# EAGLE design Keyboard (EAGLE 9.5.2)
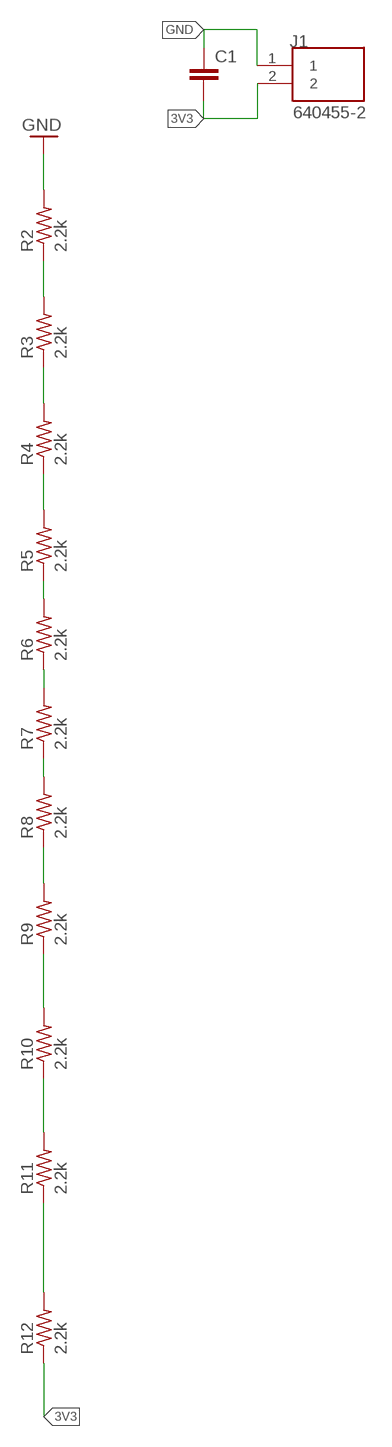
[diagram p0: schematic, sheet 1]

## Parts
C1  C-EUC0603  [C0603]
J1  640455-2  [TE_640455-2]
R2  2.2k  R-US_R0603  [R0603]
R3  2.2k  R-US_R0603  [R0603]
R4  2.2k  R-US_R0603  [R0603]
R5  2.2k  R-US_R0603  [R0603]
R6  2.2k  R-US_R0603  [R0603]
R7  2.2k  R-US_R0603  [R0603]
R8  2.2k  R-US_R0603  [R0603]
R9  2.2k  R-US_R0603  [R0603]
R10  2.2k  R-US_R0603  [R0603]
R11  2.2k  R-US_R0603  [R0603]
R12  2.2k  R-US_R0603  [R0603]

## Nets
3V3: C1.2 J1.2 R12.1
GND: C1.1 J1.1 R2.2
STEP2: R2.1 R3.2
STEP3: R3.1 R4.2
STEP4: R4.1 R5.2
STEP5: R5.1 R6.2
STEP6: R6.1 R7.2
STEP7: R7.1 R8.2
STEP8: R8.1 R9.2
STEP9: R9.1 R10.2
STEP10: R10.1 R11.2
STEP11: R11.1 R12.2

## Library data of the parts
C1 = rcl:C-EU: CAPACITOR, European symbol; SPICEPREFIX: C
J1 = 640455-2:640455-2; AVAILABILITY: Unavailable; COMMENT: 640455-2; DESCRIPTION: MTA-100 2 Position 2.54 mm Single Row Right Angle Wire to Board Header; EU_ROHS_COMPLIANCE: Compliant; MF: TE Connectivity; MP: 640455-2; PACKAGE: None; PRICE: None; TE_PURCHASE_URL: https://www.te.com/usa-en/product-640455-2.html?te_bu=Cor&te_type=disp&te_campaign=seda_glo_cor-seda-global-disp-prtnr-fy19-seda-model-bom-cta_sma-317_1&elqCampaignId=32493
R2-R12 = rcl:R-US_: RESISTOR, American symbol

## Board
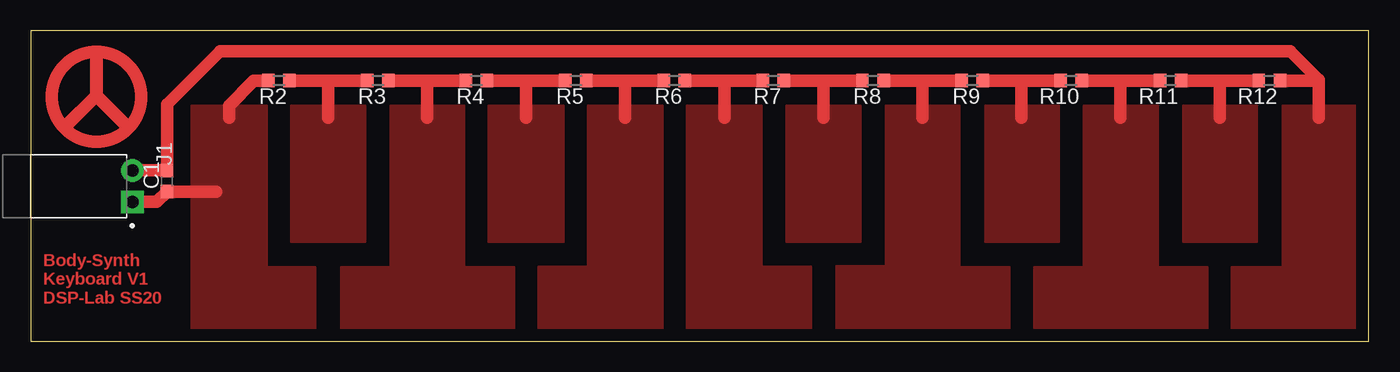
[diagram p1: board, top side]

Size 108.02 x 25.03 mm. Coordinates in mm from the lower left corner, seen from the top.
Outline: 0,0 108.02,0 108.02,25.03 0,25.03 0,0
Copper layers (1*16): Top 0.035mm / dielectric 1.5mm / Bottom 0.035mm
Design rules "Projektlabor_THT_DRC_2019": minimum track width 0.8mm, minimum drill 0.6mm, track to track 15mil, track to pad 12mil, pad to pad 16mil, via to via 20mil, smd to smd 8mil, copper to edge 40mil, drill to drill 16mil, minimum pad ring 16mil, minimum via ring 14mil, stop-mask expansion 4mil, vias tented up to drill 0mil, thermal gap 15mil

### Footprints (pad centres in the part's own frame; a part is rotated, then mirrored left to right if it is on the bottom)
C0603 = smd 1.1 x 1: 1 -0.85,0; 2 0.85,0
TE_640455-2 = drill 1.02 pad 1.37 square: 1 0,0 | drill 1.02 pad 1.37: 2 -2.54,0
R0603 = smd 1 x 1.1: 1 -0.85,0; 2 0.85,0

### Placement (x,y rotation side)
C1  10.99,12.91 90 top
J1  8.19,11.23 270 top
R2  20.02,21.03 180 top
R3  28.01,21.03 180 top
R4  35.96,21.03 180 top
R5  44.01,21.03 180 top
R6  51.96,21.03 180 top
R7  59.95,21.03 180 top
R8  68,21.03 180 top
R9  76.02,21.03 180 top
R10  84,21.03 180 top
R11  92.02,21.03 180 top
R12  100.01,21.03 180 top

### Tracks (layer width: path | path; a pad name or v marks a point on that pad's centre or on a via)
3V3
  Top 0.813: C1.2
  Top 1.016: R12.1 103.99,21.03 | 103.99,18.01 103.99,21.03 | 103.99,21.03 103.99,21.11 101.69,23.41 15.29,23.41 10.99,19.11 C1.2 | J1.2 C1.2
  pour Top: 101.08,19.01 101.08,5.95 96.97,5.95 96.97,0.97 106.94,0.97 106.99,19.01
GND
  Top 0.813: 14.94,12.06 14.99,12.01
  Top 1.016: J1.1 10.16,11.23 C1.1 14.94,12.06 | R2.2 19.15,21.01 17.99,21.01 15.99,19.01 15.99,18.01
  pour Top: 12.97,19.01 12.97,0.97 22.96,0.97 22.96,5.95 19.05,5.95 19.05,19.01
STEP2
  Top 1.016: R2.1 23.99,21.03 | 23.99,18.01 23.99,21.03 | 23.99,21.03 R3.2
  pour Top: 21.02,19.01 21.02,8.02 26.97,8.02 26.97,19.01
STEP3
  Top 1.016: R3.1 31.99,21.03 | 31.99,18.01 31.99,21.03 | 31.99,21.03 R4.2
  pour Top: 29.04,19.01 29.04,5.95 25.03,5.95 25.03,0.97 39,0.97 39,5.95 34.99,5.95 34.99,19.01
STEP4
  Top 1.016: R4.1 39.99,21.03 | 39.99,18.01 39.99,21.03 | 39.99,21.03 R5.2
  pour Top: 36.96,19.01 36.96,8.02 43.01,8.02 43.01,19.01
STEP5
  Top 1.016: R5.1 47.99,21.03 | 47.99,18.01 47.99,21.03 | 47.99,21.03 R6.2
  pour Top: 40.99,6.01 44.99,6.01 44.99,19.01 50.99,19.01 50.99,1.01 40.99,1.01
STEP6
  Top 1.016: R6.1 55.99,21.03 | 55.99,18.01 55.99,21.03 | 55.99,21.03 R7.2
  pour Top: 52.99,19.01 52.99,1.01 62.99,1.01 62.99,6.01 58.99,6.01 58.99,19.01
STEP7
  Top 1.016: R7.1 63.99,21.03 | 63.99,18.01 63.99,21.03 | 63.99,21.03 R8.2
  pour Top: 61.02,19.01 61.02,8.02 66.97,8.02 66.97,19.01
STEP8
  Top 1.016: R8.1 71.99,21.03 | 71.99,21.03 R9.2 | 71.99,18.01 71.99,21.03
  pour Top: 69.04,19.01 69.04,6.05 65.03,6.05 65.03,0.97 79,0.97 79,5.95 74.99,5.95 74.99,19.01
STEP9
  Top 1.016: R9.1 79.99,21.03 | 79.99,21.03 R10.2 | 79.99,18.01 79.99,21.03
  pour Top: 77.06,19.01 77.06,8.02 83.01,8.02 83.01,19.01
STEP10
  Top 1.016: R10.1 87.99,21.03 | 87.99,18.01 87.99,21.03 | R11.2 87.99,21.03
  pour Top: 85.04,19.01 85.04,5.95 81.03,5.95 81.03,0.97 95,0.97 95,5.95 90.99,5.95 90.99,19.01
STEP11
  Top 1.016: R11.1 95.99,21.03 | 95.99,21.03 R12.2 | 95.99,18.01 95.99,21.03
  pour Top: 93.06,19.01 93.06,8.02 99.01,8.02 99.01,19.01
(copper drawn outside any net)
  shapes: Top area x3, Top circle x1

### Text on the board
Top: Body-Synth / Keyboard V1 / DSP-Lab SS20